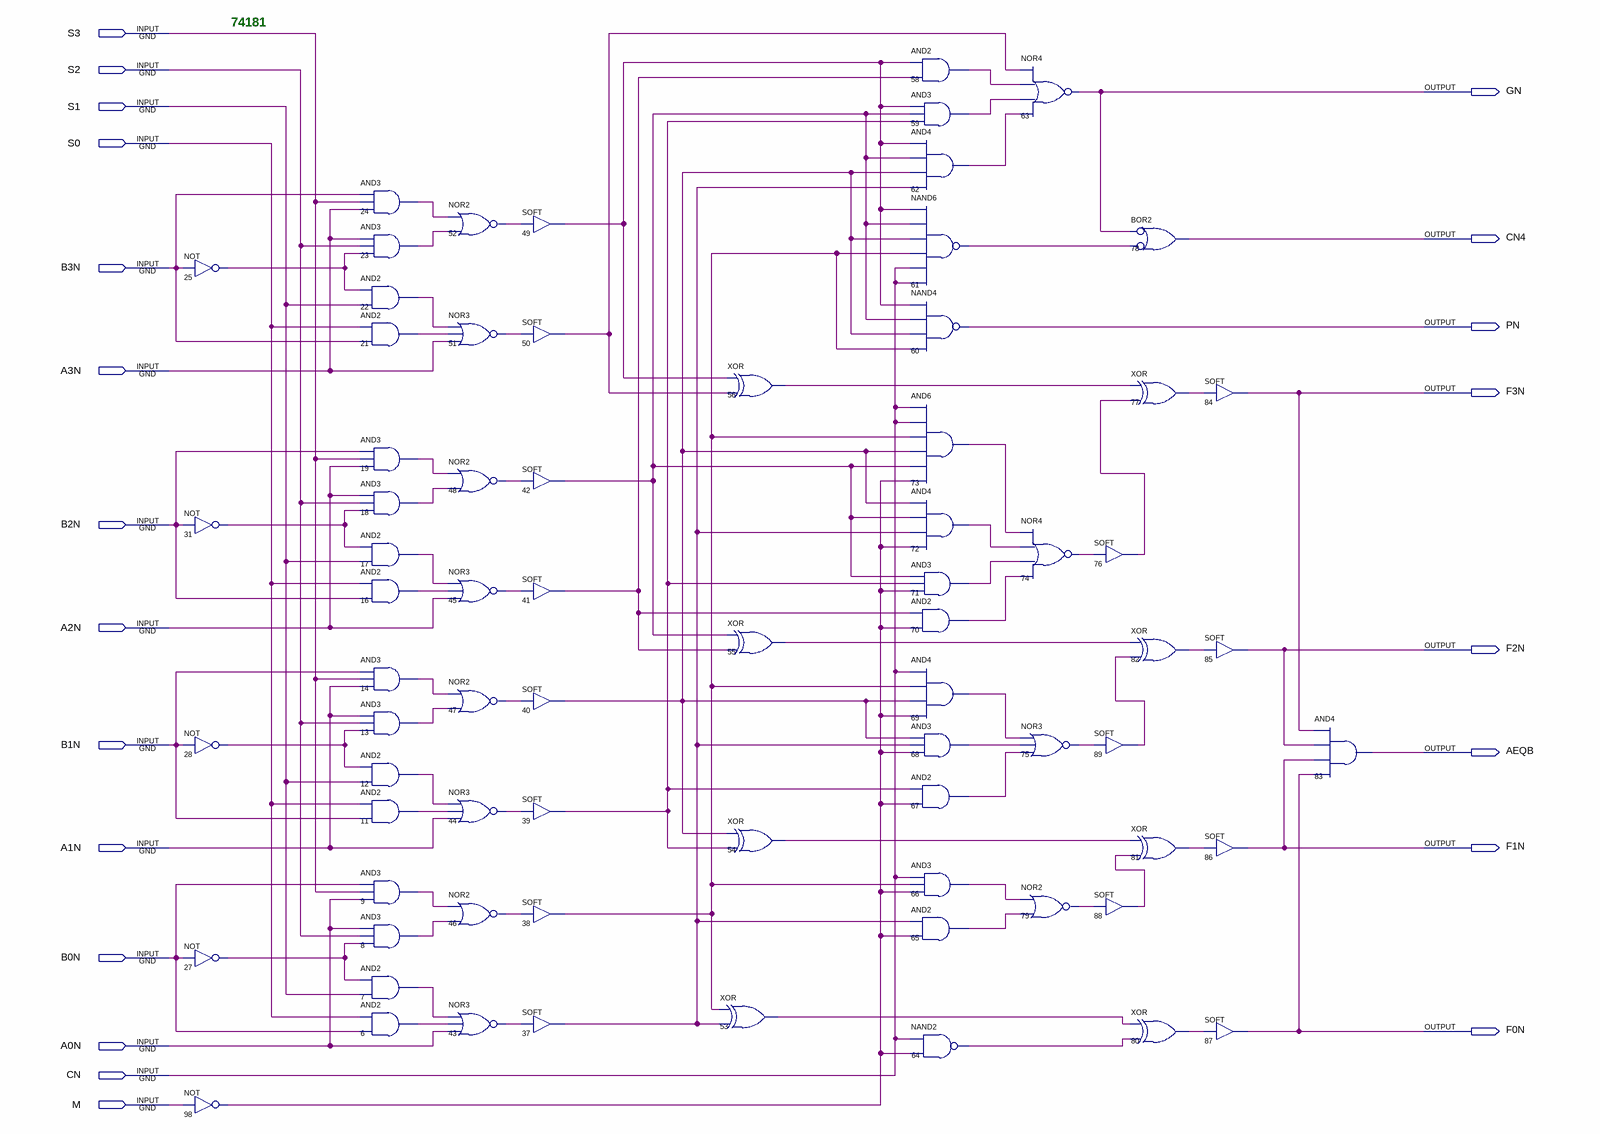
[diagram p0: schematic sheet]
// Quartus schematic 74181.bdf as structural Verilog: 73 symbols, 22 pins
module \74181  (
  input  S3,
  input  S2,
  input  S1,
  input  S0,
  input  B3N,
  input  A3N,
  input  B2N,
  input  A2N,
  input  B1N,
  input  A1N,
  input  B0N,
  input  A0N,
  input  CN,
  input  M,
  output GN,
  output CN4,
  output PN,
  output F3N,
  output F2N,
  output AEQB,
  output F1N,
  output F0N
);

  wire n6_out, n7_out, n8_out, n9_out, n11_out, n12_out, n13_out, n14_out, n16_out, n17_out, n18_out,
       n19_out, n21_out, n22_out, n23_out, n24_out, n25_out, n27_out, n28_out, n31_out, n37_out, n38_out,
       n39_out, n40_out, n41_out, n42_out, n43_out, n44_out, n45_out, n46_out, n47_out, n48_out, n49_out,
       n50_out, n51_out, n52_out, n53_out, n54_out, n55_out, n56_out, n58_out, n59_out, n61_out, n62_out,
       n64_out, n65_out, n66_out, n67_out, n68_out, n69_out, n70_out, n71_out, n72_out, n73_out, n74_out,
       n75_out, n76_out, n77_out, n79_out, n80_out, n81_out, n82_out, n88_out, n89_out, n98_out;

  not u_25 (n25_out, B3N);
  not u_31 (n31_out, B2N);
  not u_28 (n28_out, B1N);
  not u_27 (n27_out, B0N);
  not u_98 (n98_out, M);
  and u_24 (n24_out, B3N, S3, A3N);
  and u_23 (n23_out, A3N, S2, n25_out);
  and u_22 (n22_out, n25_out, S1);
  and u_21 (n21_out, S0, B3N);
  and u_19 (n19_out, B2N, S3, A2N);
  and u_18 (n18_out, A2N, S2, n31_out);
  and u_17 (n17_out, n31_out, S1);
  and u_16 (n16_out, S0, B2N);
  and u_14 (n14_out, B1N, S3, A1N);
  and u_13 (n13_out, A1N, S2, n28_out);
  and u_12 (n12_out, n28_out, S1);
  and u_11 (n11_out, S0, B1N);
  and u_9 (n9_out, B0N, S3, A0N);
  and u_8 (n8_out, A0N, S2, n27_out);
  and u_7 (n7_out, n27_out, S1);
  and u_6 (n6_out, S0, B0N);
  nor u_52 (n52_out, n24_out, n23_out);
  nor u_51 (n51_out, n22_out, n21_out, A3N);
  nor u_48 (n48_out, n19_out, n18_out);
  nor u_45 (n45_out, n17_out, n16_out, A2N);
  nor u_47 (n47_out, n14_out, n13_out);
  nor u_44 (n44_out, n12_out, n11_out, A1N);
  nor u_46 (n46_out, n9_out, n8_out);
  nor u_43 (n43_out, n7_out, n6_out, A0N);
  SOFT u_49 (.IN(n52_out), .OUT(n49_out));
  SOFT u_50 (.IN(n51_out), .OUT(n50_out));
  SOFT u_42 (.IN(n48_out), .OUT(n42_out));
  SOFT u_41 (.IN(n45_out), .OUT(n41_out));
  SOFT u_40 (.IN(n47_out), .OUT(n40_out));
  SOFT u_39 (.IN(n44_out), .OUT(n39_out));
  SOFT u_38 (.IN(n46_out), .OUT(n38_out));
  SOFT u_37 (.IN(n43_out), .OUT(n37_out));
  xor u_56 (n56_out, n49_out, n50_out);
  xor u_55 (n55_out, n42_out, n41_out);
  xor u_54 (n54_out, n40_out, n39_out);
  xor u_53 (n53_out, n38_out, n37_out);
  and u_58 (n58_out, n49_out, n41_out);
  and u_59 (n59_out, n49_out, n42_out, n39_out);
  and u_62 (n62_out, n49_out, n42_out, n40_out, n37_out);
  nand u_61 (n61_out, n49_out, n42_out, n40_out, n38_out, CN, CN);
  nand u_60 (PN, n49_out, n42_out, n40_out, n38_out);
  and u_73 (n73_out, CN, CN, n38_out, n40_out, n42_out, n98_out);
  and u_72 (n72_out, n40_out, n42_out, n37_out, n98_out);
  and u_71 (n71_out, n42_out, n39_out, n98_out);
  and u_70 (n70_out, n41_out, n98_out);
  and u_69 (n69_out, CN, n38_out, n40_out, n98_out);
  and u_68 (n68_out, n40_out, n37_out, n98_out);
  and u_67 (n67_out, n39_out, n98_out);
  and u_66 (n66_out, CN, n38_out, n98_out);
  and u_65 (n65_out, n37_out, n98_out);
  nand u_64 (n64_out, CN, n98_out);
  nor u_63 (GN, n50_out, n58_out, n59_out, n62_out);
  nor u_74 (n74_out, n73_out, n72_out, n71_out, n70_out);
  nor u_75 (n75_out, n69_out, n68_out, n67_out);
  nor u_79 (n79_out, n66_out, n65_out);
  SOFT u_76 (.IN(n74_out), .OUT(n76_out));
  SOFT u_89 (.IN(n75_out), .OUT(n89_out));
  SOFT u_88 (.IN(n79_out), .OUT(n88_out));
  or u_78 (CN4, ~GN, ~n61_out);  // BOR2
  xor u_77 (n77_out, n56_out, n76_out);
  xor u_82 (n82_out, n55_out, n89_out);
  xor u_81 (n81_out, n54_out, n88_out);
  xor u_80 (n80_out, n53_out, n64_out);
  SOFT u_84 (.IN(n77_out), .OUT(F3N));
  SOFT u_85 (.IN(n82_out), .OUT(F2N));
  SOFT u_86 (.IN(n81_out), .OUT(F1N));
  SOFT u_87 (.IN(n80_out), .OUT(F0N));
  and u_83 (AEQB, F3N, F2N, F1N, F0N);

  // Notes on the sheet:
  //   74181
endmodule
